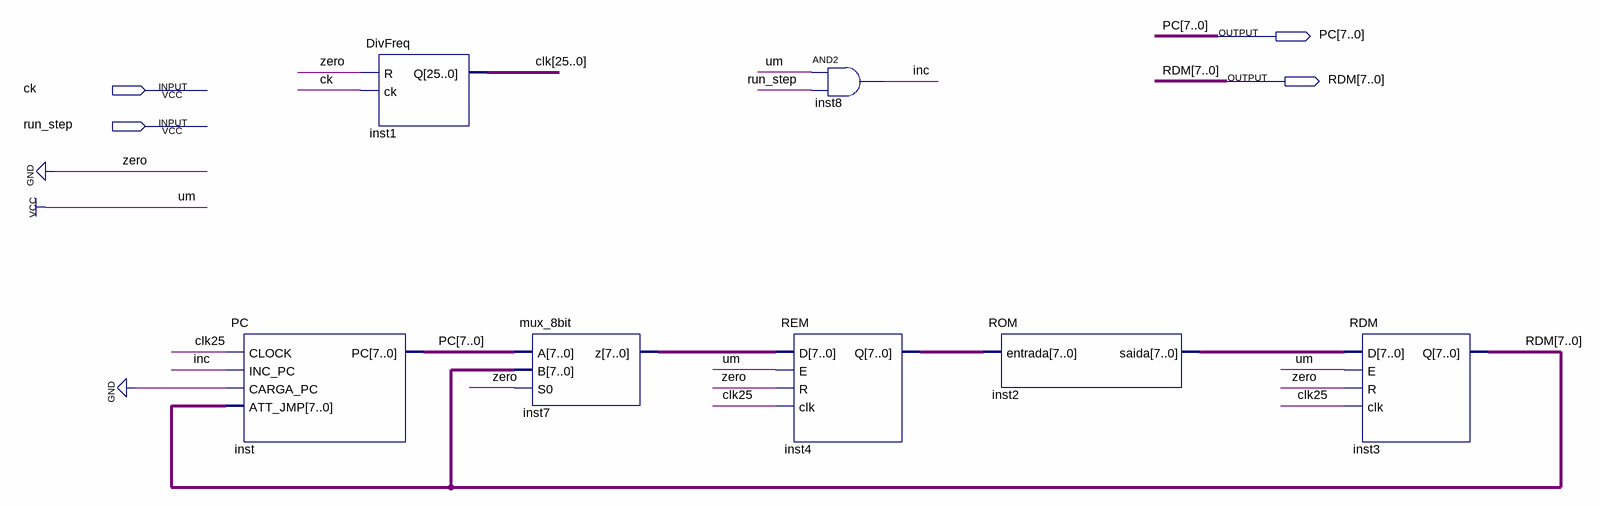
[diagram p0: schematic sheet]
// Quartus schematic PCeMemoria.bdf as structural Verilog: 7 symbols, 4 pins
module PCeMemoria (
  input  ck,
  input  run_step,
  output [7:0] PC,
  output [7:0] RDM
);

  wire inc;
  wire [7:0] inst2_saida, inst4_q, inst7_z;
  wire [25:0] clk;

  PC inst (.CLOCK(clk[25]), .INC_PC(inc), .CARGA_PC(1'b0), .ATT_JMP(RDM), .PC(PC));
  DivFreq inst1 (.R(1'b0), .ck(ck), .Q(clk));
  mux_8bit inst7 (.A(PC), .B(RDM), .S0(1'b0), .z(inst7_z));
  REM inst4 (.D(inst7_z), .E(1'b1), .R(1'b0), .clk(clk[25]), .Q(inst4_q));
  and inst8 (inc, 1'b1, run_step);
  ROM inst2 (.entrada(inst4_q), .saida(inst2_saida));
  RDM inst3 (.D(inst2_saida), .E(1'b1), .R(1'b0), .clk(clk[25]), .Q(RDM));
endmodule
